# Altium schematic sheet Ingresso_1.1SchDoc.SchDoc: INGRESSO
size A4; SheetNumber: 1; SheetTotal: 3
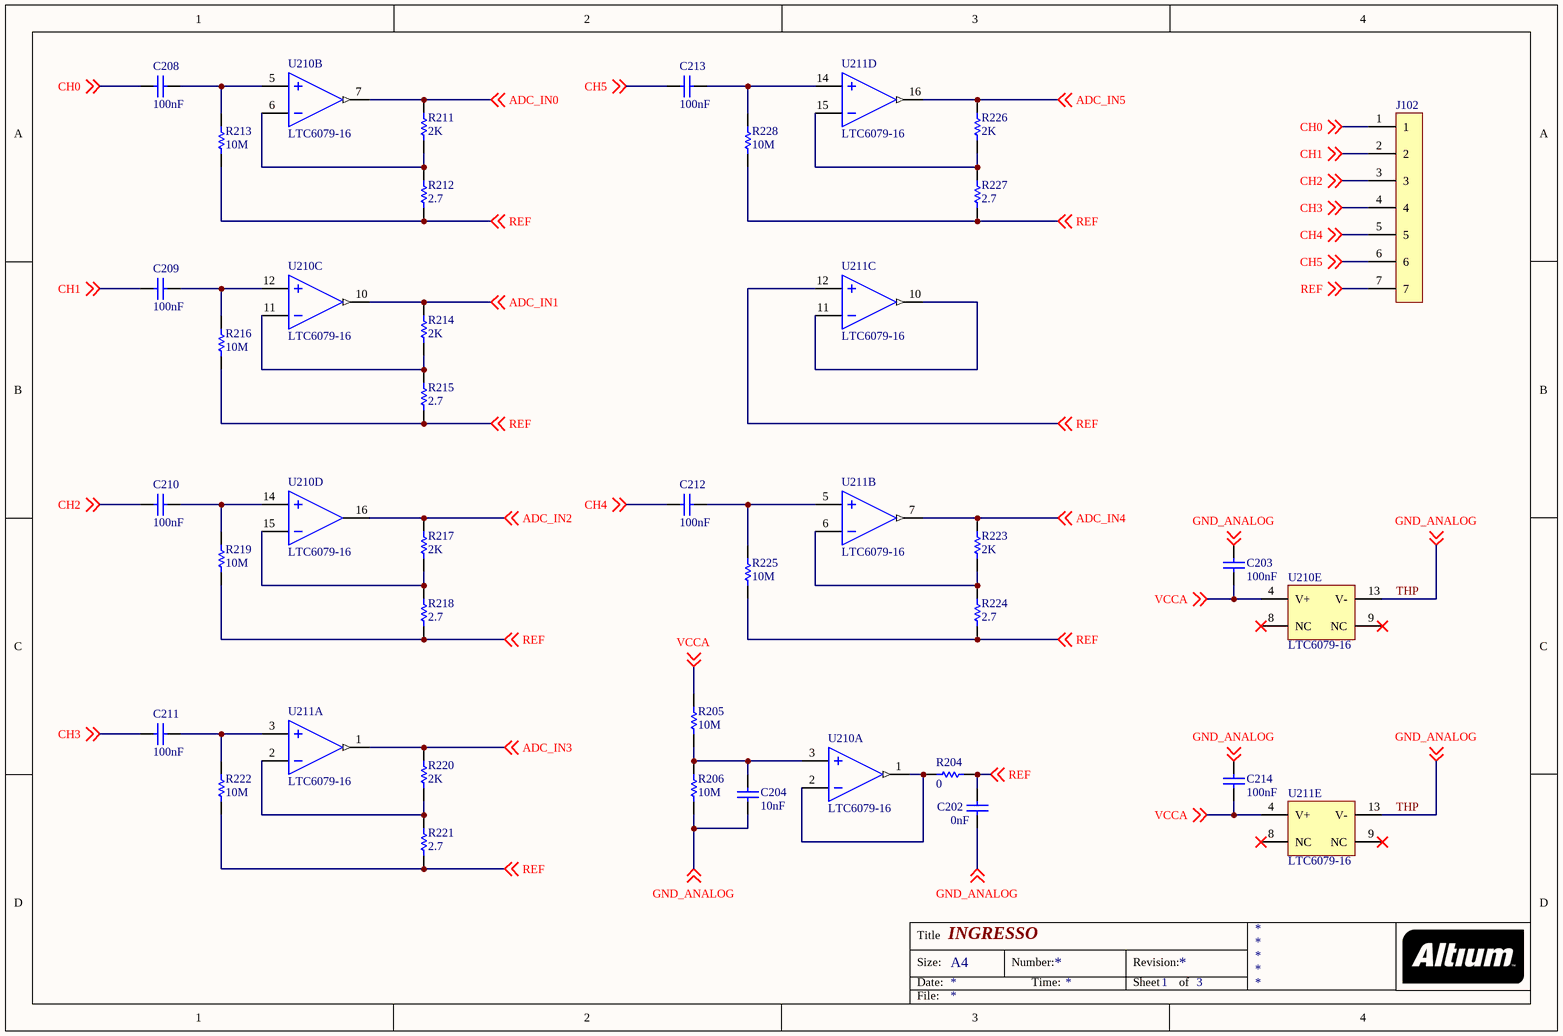
[diagram p0: Ingresso_1.1SchDoc.SchDoc]

## Parts
C202  0nF  [0402 Capacitor]
C203  100nF  [0402 Capacitor]
C204  10nF  [0402 Capacitor]
C208  100nF  [0402 Capacitor]
C209  100nF  [0402 Capacitor]
C210  100nF  [0402 Capacitor]
C211  100nF  [0402 Capacitor]
C212  100nF  [0402 Capacitor]
C213  100nF  [0402 Capacitor]
C214  100nF  [0402 Capacitor]
J102  HEADER 1X7  [HEADER 1X7]  (value not drawn)
R204  0  [0402 resistor]
R205  10M  [0402 resistor]
R206  10M  [0402 resistor]
R211  2K  [0402 resistor]
R212  2.7  [0402 resistor]
R213  10M  [0402 resistor]
R214  2K  [0402 resistor]
R215  2.7  [0402 resistor]
R216  10M  [0402 resistor]
R217  2K  [0402 resistor]
R218  2.7  [0402 resistor]
R219  10M  [0402 resistor]
R220  2K  [0402 resistor]
R221  2.7  [0402 resistor]
R222  10M  [0402 resistor]
R223  2K  [0402 resistor]
R224  2.7  [0402 resistor]
R225  10M  [0402 resistor]
R226  2K  [0402 resistor]
R227  2.7  [0402 resistor]
R228  10M  [0402 resistor]
U210  LTC6079-16  (parts A,B,C,D,E of 5)
U211  LTC6079-16  (parts A,B,C,D,E of 5)

## Nets
ADC_IN0: R211.2 U210.7(OUT_B) ; off-sheet ADC_IN0
ADC_IN1: R214.2 U210.10(OUT_C) ; off-sheet ADC_IN1
ADC_IN2: R217.2 U210.16(OUT_D) ; off-sheet ADC_IN2
ADC_IN3: R220.2 U211.1(OUT_A) ; off-sheet ADC_IN3
ADC_IN4: R223.2 U211.7(OUT_B) ; off-sheet ADC_IN4
ADC_IN5: R226.2 U211.16(OUT_D) ; off-sheet ADC_IN5
CH0: C208.1 J102.1 ; off-sheet CH0
CH1: C209.1 J102.2 ; off-sheet CH1
CH2: C210.1 J102.3 ; off-sheet CH2
CH3: C211.1 J102.4 ; off-sheet CH3
CH4: C212.1 J102.5 ; off-sheet CH4
CH5: C213.1 J102.6 ; off-sheet CH5
REF: C202.2 J102.7 R204.2 R212.1 R213.1 R215.1 R216.1 R218.1 R219.1 R221.2 R222.1 R224.1 R225.1 R227.1 R228.1 U211.12(IN+_C) ; off-sheet REF
THP: C202.1 C203.2 C204.1 C214.2 R206.1 U210.13(V-) U211.13(V-) ; off-sheet GND_ANALOG  [also labelled GND_ANALOG]
VCCA: C203.1 C214.1 R205.2 U210.4(V+) U211.4(V+) ; off-sheet VCCA
NetC204_2: C204.2 R205.1 R206.2 U210.3(IN+_A)
NetC208_2: C208.2 R213.2 U210.5(IN+_B)
NetC209_2: C209.2 R216.2 U210.12(IN+_C)
NetC210_2: C210.2 R219.2 U210.14(IN+_D)
NetC211_2: C211.2 R222.2 U211.3(IN+_A)
NetC212_2: C212.2 R225.2 U211.5(IN+_B)
NetC213_2: C213.2 R228.2 U211.14(IN+_D)
NetR204_1: R204.1 U210.1(OUT_A) U210.2(IN-_A)
NetR211_1: R211.1 R212.2 U210.6(IN-_B)
NetR214_1: R214.1 R215.2 U210.11(IN-_C)
NetR217_1: R217.1 R218.2 U210.15(IN-_D)
NetR220_1: R220.1 R221.1 U211.2(IN-_A)
NetR223_1: R223.1 R224.2 U211.6(IN-_B)
NetR226_1: R226.1 R227.2 U211.15(IN-_D)
NetU211_10: U211.10(OUT_C) U211.11(IN-_C)

Not connected (* = marked no-connect by the designer): U210 8(NC)* 9(NC)*; U211 8(NC)* 9(NC)*

## Notes on the sheet
- Title
- Size:
- Date:
- A4
- Number:
- Time:
- Revision:
- Sheet
- of
- File:

## Library data of the parts
C202-C204 C208-C214 = Cap SMD: Capacitor SMD 0402; Manufacturer: MULTICOMP; Manufacturer Part Number: MC0402X104M160CT; Code_IEC: 1005; Published: 8-Jun-2000; LatestRevisionDate: 29-May-2009; LatestRevisionNote: IPC-7351 Footprint Added.; PackageReference: 0402-A; Publisher: Altium Limited; PackageDescription: Chip Inductor; Code_JEITA: 0402; Supplier 1: Farnell; RoHS: YES; Stock 1: 436; Pricing 1: 1=0,003, 10=0,003, 100=0,003, 500=0,002, 1000=0,002 (EUR); ComponentLink1URL: http://www.newark.com/pdfs/datasheets/spc/Ta-1103.pdf; ComponentLink1Description: http://www.newark.com/pdfs/datasheets/spc/Ta-1103.pdf; Supplier Part Number 1: 1709894
  C202: Value: 0nF
  C203 C208-C214: Value: 100nF
  C204: Value: 10nF
J102 = HEADER 1X7: Inductor; Code_IEC: 1005; Published: 8-Jun-2000; LatestRevisionDate: 29-May-2009; LatestRevisionNote: IPC-7351 Footprint Added.; PackageReference: 0402-A; Publisher: Altium Limited; PackageDescription: Chip Inductor; Code_JEITA: 0402
R204-R206 R211-R228 = RSMD: Resistor SMD 0402; Manufacturer: MULTICOMP; Manufacturer Part Number: MC00625W040212K; Gamma Prodotti: MULTICOMP - MC Series; Livello di Potenza: 62.5; Tolleranza Resistenza: ± 1%; Modello Case Resistore: 0402 [1005 Metric]; Materiale Elemento Resistivo: Film Spesso; Coefficiente di Temperatura: ± 100; Tensione Nominale: 50; Imballaggio: Nastro; Sostanze Estremamente Preoccupanti (SVHC): No SVHC (16-Jun-2014); Coefficiente di Temperatura +: 100; Intervallo Temperatura di Esercizio: da -55°C a +155; Larghezza Esterna: 1; Lunghezza/Altezza Esterna: 0.35; No. di Pin: 2; Profondità Esterna: 0.5; Serie: MC; Temperatura di Esercizio Max: 155; Temperatura di Esercizio Min: -55; Tolleranza +: 1%; Supplier 1: Farnell; RoHS: Y-EX; Stock 1: 19850; Pricing 1: 50=0,02, 250=0,019, 1000=0,016, 5000=0,012, 15000=0,011 (EUR); Livello di Sensibilità all'Umidità (MSL): -; Coefficiente di Temperatura -: 100; Montaggio Resistore: SMD; Tensione Nominale V DC: 50; Tolleranza -: 1; ComponentLink1URL: http://www.farnell.com/datasheets/1729045.pdf; ComponentLink1Description: http://www.farnell.com/datasheets/1729045.pdf; ComponentLink2URL: http://www.farnell.com/cad/1558901.zip; ComponentLink2Description: http://www.farnell.com/cad/1558901.zip; Supplier Part Number 1: 1358050
  R204: Resistenza: 0
  R205 R206 R213 R216 R219 R222 R225 R228: Resistenza: 10M
  R211 R214 R217 R220 R223 R226: Resistenza: 2K
  R212 R215 R218 R221 R224 R227: Resistenza: 2.7
U210 U211 = LT-LTC608X-LTC607X-16